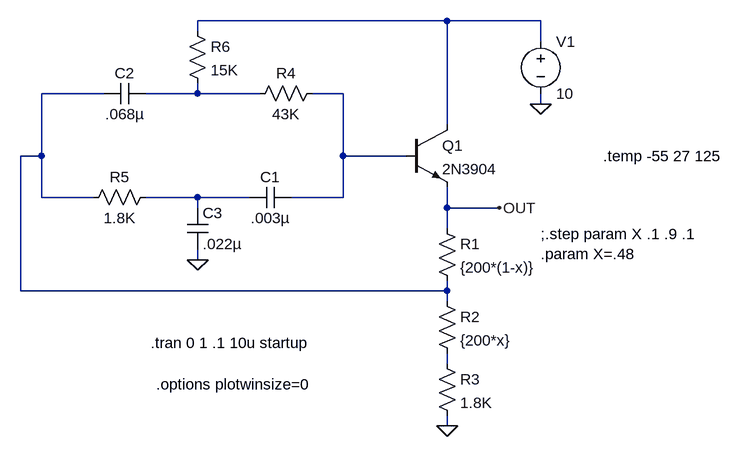
[diagram p0: schematic FollowerOSC.asc]
FollowerOSC.asc, the LTspice schematic file:
Version 4
SHEET 1 880 680
WIRE 352 -32 -32 -32
WIRE 496 -32 352 -32
WIRE -32 -16 -32 -32
WIRE 496 0 496 -32
WIRE -176 80 -272 80
WIRE -32 80 -32 64
WIRE -32 80 -112 80
WIRE 64 80 -32 80
WIRE 192 80 144 80
WIRE 496 96 496 80
WIRE 352 128 352 -32
WIRE -272 176 -272 80
WIRE -272 176 -304 176
WIRE 192 176 192 80
WIRE 288 176 192 176
WIRE -272 240 -272 176
WIRE -192 240 -272 240
WIRE -32 240 -112 240
WIRE 48 240 -32 240
WIRE 192 240 192 176
WIRE 192 240 112 240
WIRE -32 256 -32 240
WIRE 352 256 352 224
WIRE 432 256 352 256
WIRE 352 288 352 256
WIRE -32 336 -32 320
WIRE -304 384 -304 176
WIRE 352 384 352 368
WIRE 352 384 -304 384
WIRE 352 400 352 384
WIRE 352 496 352 480
WIRE 352 592 352 576
FLAG 352 592 0
FLAG -32 336 0
FLAG 496 96 0
FLAG 432 256 OUT
SYMBOL npn 288 128 R0
SYMATTR InstName Q1
SYMATTR Value 2N3904
SYMBOL res 336 272 R0
SYMATTR InstName R1
SYMATTR Value {200*(1-x)}
SYMBOL res 336 384 R0
SYMATTR InstName R2
SYMATTR Value {200*x}
SYMBOL res 336 480 R0
SYMATTR InstName R3
SYMATTR Value 1.8K
SYMBOL res 160 64 R90
WINDOW 0 0 56 VBottom 2
WINDOW 3 32 56 VTop 2
SYMATTR InstName R4
SYMATTR Value 43K
SYMBOL res -96 224 R90
WINDOW 0 0 56 VBottom 2
WINDOW 3 32 56 VTop 2
SYMATTR InstName R5
SYMATTR Value 1.8K
SYMBOL res -48 -32 R0
SYMATTR InstName R6
SYMATTR Value 15K
SYMBOL cap 112 224 R90
WINDOW 0 0 32 VBottom 2
WINDOW 3 32 32 VTop 2
SYMATTR InstName C1
SYMATTR Value .003µ
SYMBOL cap -112 64 R90
WINDOW 0 0 32 VBottom 2
WINDOW 3 32 32 VTop 2
SYMATTR InstName C2
SYMATTR Value .068µ
SYMBOL cap -48 256 R0
SYMATTR InstName C3
SYMATTR Value .022µ
SYMBOL voltage 496 -16 R0
SYMATTR InstName V1
SYMATTR Value 10
TEXT -104 464 Left 2 !.tran 0 1 .1 10u startup
TEXT 496 296 Left 2 !;.step param X .1 .9 .1\n.param X=.48
TEXT -96 528 Left 2 !.options plotwinsize=0
TEXT 592 176 Left 2 !.temp -55 27 125

The netlist it stands for:
* FollowerOSC.asc
Q1 N001 N004 OUT 0 2N3904
R1 OUT N002 {200*(1-x)}
R2 N002 N006 {200*x}
R3 N006 0 1.8K
R4 N004 N003 43K
R5 N005 N002 1.8K
R6 N001 N003 15K
C1 N004 N005 .003µ
C2 N003 N002 .068µ
C3 N005 0 .022µ
V1 N001 0 10
.model NPN NPN
.model PNP PNP
.lib standard.bjt
.tran 0 1 .1 10u startup
;.step param X .1 .9 .1
.param X=.48
.options plotwinsize=0
.temp -55 27 125
.backanno
.end